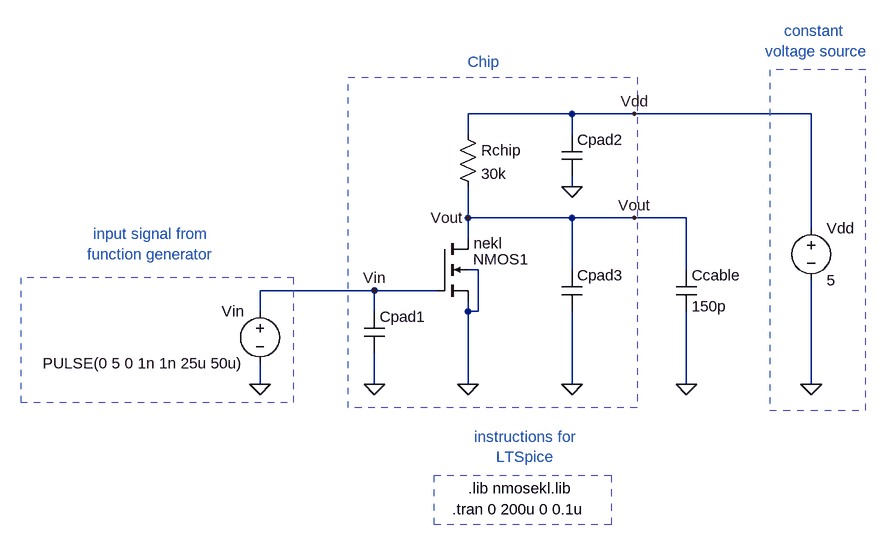
[diagram p0: schematic NMOS_EKL_digital_template_XYZ.asc]
NMOS_EKL_digital_template_XYZ.asc, the LTspice schematic file:
Version 4
SHEET 1 1212 680
WIRE 432 -48 272 -48
WIRE 528 -48 432 -48
WIRE 800 -48 528 -48
WIRE 272 -16 272 -48
WIRE 432 -16 432 -48
WIRE 432 64 432 48
WIRE 272 112 272 64
WIRE 432 112 272 112
WIRE 528 112 432 112
WIRE 608 112 528 112
WIRE 800 128 800 -48
WIRE 272 144 272 112
WIRE 288 192 272 192
WIRE 432 192 432 112
WIRE 608 192 608 112
WIRE 128 224 -48 224
WIRE 224 224 128 224
WIRE -48 256 -48 224
WIRE 128 256 128 224
WIRE 272 256 272 240
WIRE 288 256 288 192
WIRE 288 256 272 256
WIRE -48 368 -48 336
WIRE 128 368 128 320
WIRE 272 368 272 256
WIRE 432 368 432 256
WIRE 608 368 608 256
WIRE 800 368 800 208
FLAG 272 368 0
FLAG 128 368 0
FLAG 800 368 0
FLAG 272 112 Vout
FLAG 432 64 0
FLAG -48 368 0
FLAG 432 368 0
FLAG 128 224 Vin
FLAG 608 368 0
FLAG 528 112 Vout
FLAG 528 -48 Vdd
SYMBOL nmos4 224 144 R0
WINDOW 3 57 7 Left 2
SYMATTR Value nekl
SYMATTR InstName NMOS1
SYMATTR Value2 l=20u w=30u
SYMBOL voltage -48 240 M0
WINDOW 123 0 0 Left 2
WINDOW 39 0 0 Left 2
SYMATTR InstName Vin
SYMATTR Value PULSE(0 5 0 1n 1n 25u 50u)
SYMBOL voltage 800 112 R0
WINDOW 123 0 0 Left 2
WINDOW 39 0 0 Left 2
SYMATTR InstName Vdd
SYMATTR Value 5
SYMBOL res 256 -32 R0
SYMATTR InstName Rchip
SYMATTR Value 30k
SYMBOL cap 416 -16 R0
SYMATTR InstName Cpad2
SYMATTR Value ""
SYMBOL cap 112 256 R0
SYMATTR InstName Cpad1
SYMATTR Value ""
SYMBOL cap 416 192 R0
SYMATTR InstName Cpad3
SYMATTR Value ""
SYMBOL cap 592 192 R0
SYMATTR InstName Ccable
SYMATTR Value 150p
TEXT 272 528 Left 2 !.lib nmosekl.lib
TEXT 248 560 Left 2 !.tran 0 200u 0 0.1u
TEXT 296 -128 Center 2 ;Chip
TEXT -216 152 Center 2 ;input signal from\nfunction generator
TEXT 360 464 Center 2 ;instructions for\nLTSpice
TEXT 808 -160 Center 2 ;constant \nvoltage source
RECTANGLE Normal 88 -104 532 404 2
RECTANGLE Normal 4 204 -416 396 2
RECTANGLE Normal 736 408 884 -116 2
RECTANGLE Normal 220 508 492 584 2

The netlist it stands for:
* NMOS_EKL_digital_template_XYZ.asc
M§NMOS1 Vout Vin 0 0 nekl l=20u w=30u
Vin Vin 0 PULSE(0 5 0 1n 1n 25u 50u)
Vdd Vdd 0 5
Rchip Vdd Vout 30k
Cpad2 Vdd 0
Cpad1 Vin 0
Cpad3 Vout 0
Ccable Vout 0 150p
.model NMOS NMOS
.model PMOS PMOS
.lib standard.mos
.lib nmosekl.lib
.tran 0 200u 0 0.1u
* Chip
* input signal from
* function generator
* instructions for
* LTSpice
* constant
* voltage source
.backanno
.end